# EAGLE design board (EAGLE 9.6.2)
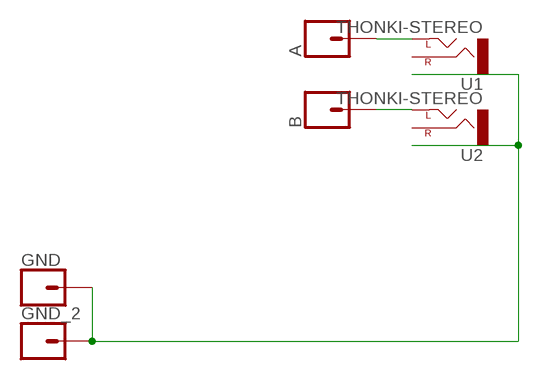
[diagram p0: schematic, sheet 1]

## Parts
A  CONN_01  [1X01]
B  CONN_01  [1X01]
GND  CONN_01  [1X01]
GND_2  CONN_01  [1X01]
U1  THONKI-STEREO  [WQP-PJ366ST_JACK]
U2  THONKI-STEREO  [WQP-PJ366ST_JACK]

## Nets
N$3: A.1 U1.P$1_TIP(LEFT)
N$4: B.1 U2.P$1_TIP(LEFT)
N$13: GND.1 GND_2.1 U1.P$3_SLEEVE(SLEEVE) U2.P$3_SLEEVE(SLEEVE)
Unconnected: U1.P$2_SWITCH(RIGHT) U2.P$2_SWITCH(RIGHT)

## Library data of the parts
A B GND GND_2 = SparkFun-Connectors:CONN_01: Single connection point. Often used as Generic Header-pin footprint for 0.1 inch spaced/style header connections On any of the 0.1 inch spaced packages, you can populate with these: Break Away Headers - Straight <https://www.sparkfun.com/products/116> (PRT-00116) Break Away Male Headers - Right Angle <https://www.sparkfun.com/products/553> (PRT-00553) Female Headers <https://www.sparkfun.com/products/115> (PRT-00115) Break Away Headers - Machine Pin <https://www.sparkfun.com/products/117> (PRT-00117) Break Away Female Headers - Swiss Machine Pin <https://www.sparkfun.com/products/743> (PRT-00743) This device is also useful as a general connection point to wire up your design to another part of your project. Our various solder wires solder well into these plated through hole pads. Hook-Up Wire - Assortment (Stranded, 22 AWG) <https://www.sparkfun.com/products/11375> (PRT-11375) Hook-Up Wire - Assortment (Solid Core, 22 AWG) <https://www.sparkfun.com/products/11367> (PRT-11367) View the entire wire category on our website here <https://www.sparkfun.com/categories/141> Special notes: SMTSO-256-ET is a "flush mount" nut for a 4-40 screw. We mostly use this on specialty testbeds; it is a nice way to connect hardware to your PCB at an adjustable hieght. Also note, the SNAP packages are for using a snappable style connector. We sell a baggie of snaps and they are also used on two LilyPad designs: Snap Assortment - 30 pack (male and female) <https://www.sparkfun.com/products/11347> (DEV-11347) LilyPad Arduino SimpleSnap <https://www.sparkfun.com/products/10941> (DEV-10941) LilyPad SimpleSnap Protoboard <https://www.sparkfun.com/products/10940> (DEV-10940)
U1 U2 = MusicThingModular:THONKI-STEREO: 3.5mm socket for Eurorack modular synths

## Board
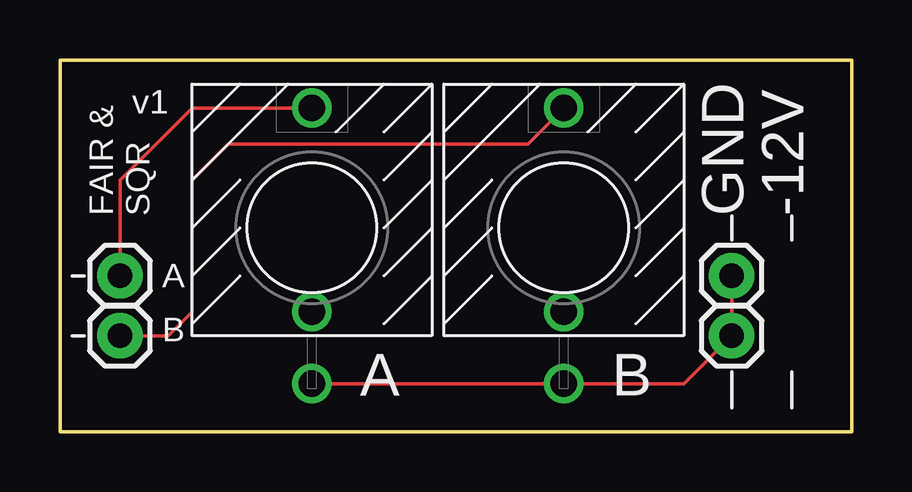
[diagram p1: board, top side]

Size 33 x 15.5 mm. Coordinates in mm from the lower left corner, seen from the top.
Outline: 33,0 0,0 0,15.5 33,15.5 33,0
Copper layers (1*16): Top 0.035mm / dielectric 1.5mm / Bottom 0.035mm
Design rules "default": minimum track width 6mil, minimum drill 0.35mm, track to track 6mil, track to pad 6mil, pad to pad 6mil, via to via 6mil, smd to smd 6mil, copper to edge 40mil, drill to drill 6mil, minimum pad ring 10mil, minimum via ring 8mil, stop-mask expansion 4mil, vias tented up to drill 0mil, thermal gap 10mil

### Footprints (pad centres in the part's own frame; a part is rotated, then mirrored left to right if it is on the bottom)
1X01 = drill 1.016 pad 1.88: 1 0,0
WQP-PJ366ST_JACK = drill 1.1: P$1_TIP 0,5; P$2_SWITCH 0,-3.5; P$3_SLEEVE 0,-6.5

### Placement (x,y rotation side)
A  2.5,4 0 top
B  2.5,6.5 0 top
GND  28,6.5 0 top
GND_2  28,4 0 top
U1  21,8.5 0 top
U2  10.5,8.5 0 top

### Tracks (layer width: path | path; a pad name or v marks a point on that pad's centre or on a via)
N$3
  Top 0.152: A.1 4.5,4 5.5,5 5.5,10.5 7,12 19.5,12 U1.P$1_TIP
N$4
  Top 0.152: B.1 2.5,10.5 5.5,13.5 U2.P$1_TIP
N$13
  Top 0.152: GND.1 GND_2.1 26,2 U1.P$3_SLEEVE U2.P$3_SLEEVE

### Text on the board
tPlace: v1 | FAIR & / SQR | GND | -12V | A | B | A | B